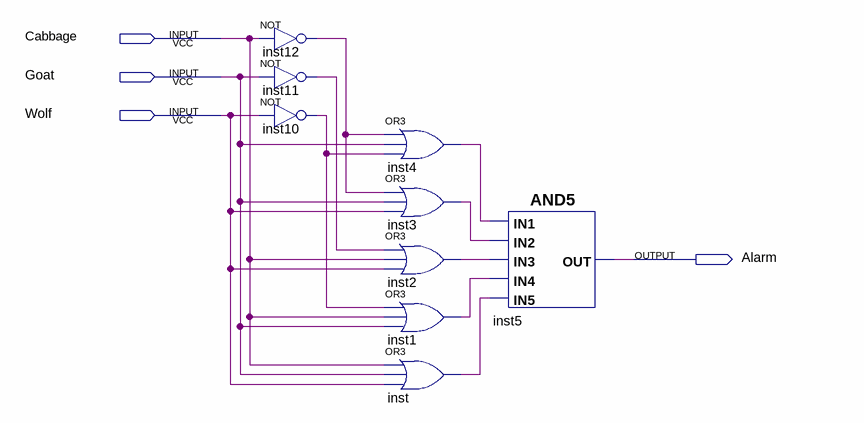
[diagram p0: schematic sheet]
// Quartus schematic main.bdf as structural Verilog: 9 symbols, 4 pins
module main (
  input  Cabbage,
  input  Goat,
  input  Wolf,
  output Alarm
);

  wire inst1_out, inst2_out, inst3_out, inst4_out, inst10_out, inst11_out, inst12_out, inst_out;

  not inst12 (inst12_out, Cabbage);
  not inst11 (inst11_out, Goat);
  not inst10 (inst10_out, Wolf);
  or inst4 (inst4_out, inst12_out, Goat, inst10_out);
  or inst3 (inst3_out, inst12_out, Goat, Wolf);
  or inst2 (inst2_out, inst11_out, Cabbage, Wolf);
  or inst1 (inst1_out, inst10_out, Cabbage, Goat);
  or inst (inst_out, Cabbage, Goat, Wolf);
  and inst5 (Alarm, inst4_out, inst3_out, inst2_out, inst1_out, inst_out);
endmodule
